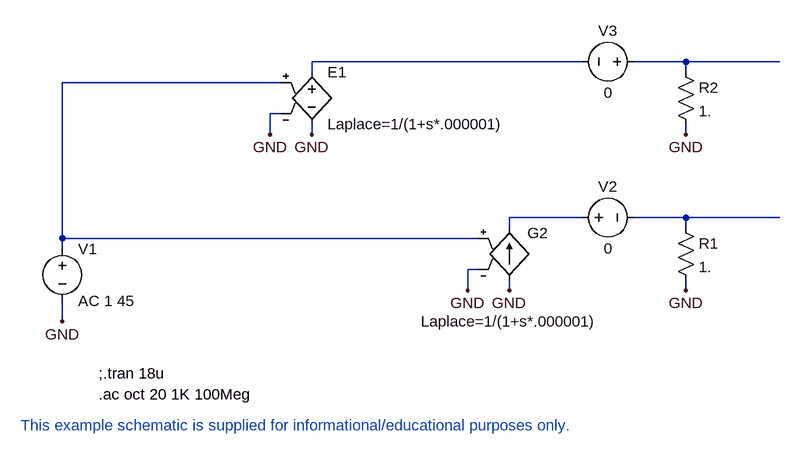
[diagram p0: schematic i.asc]
i.asc, the LTspice schematic file:
Version 4
SHEET 1 1652 896
WIRE 544 592 1184 592
WIRE 544 608 544 592
WIRE 544 688 544 720
WIRE 1232 672 1232 656
WIRE 1504 672 1504 656
WIRE 1232 576 1232 560
WIRE 1232 560 1344 560
WIRE 1504 560 1504 576
WIRE 1184 640 1168 640
WIRE 1168 640 1168 672
WIRE 1504 560 1648 560
WIRE 1424 560 1504 560
WIRE 928 432 928 416
WIRE 1504 432 1504 416
WIRE 928 336 928 320
WIRE 928 320 1344 320
WIRE 1504 320 1504 336
WIRE 880 400 864 400
WIRE 864 400 864 432
WIRE 1504 320 1648 320
WIRE 1424 320 1504 320
WIRE 880 352 544 352
WIRE 544 352 544 592
FLAG 544 720 GND
FLAG 1504 672 GND
FLAG 1232 672 GND
FLAG 1168 672 GND
FLAG 1504 432 GND
FLAG 928 432 GND
FLAG 864 432 GND
SYMBOL VOLTAGE 544 592 R0
SYMATTR InstName V1
SYMATTR Value AC 1 45
SYMBOL G 1232 560 R0
WINDOW 0 28 24 Left 0
WINDOW 3 -136 160 Left 0
SYMATTR InstName G2
SYMATTR Value Laplace=1/(1+s*.000001)
SYMBOL RES 1488 560 R0
SYMATTR InstName R1
SYMATTR Value 1.
SYMBOL voltage 1328 560 R270
WINDOW 0 32 56 VTop 0
WINDOW 3 -32 56 VBottom 0
SYMATTR InstName V2
SYMATTR Value 0
SYMBOL RES 1488 320 R0
SYMATTR InstName R2
SYMATTR Value 1.
SYMBOL voltage 1440 320 M270
WINDOW 0 32 56 VTop 0
WINDOW 3 -32 56 VBottom 0
SYMATTR InstName V3
SYMATTR Value 0
SYMBOL e 928 320 R0
SYMATTR InstName E1
SYMATTR Value Laplace=1/(1+s*.000001)
TEXT 600 832 Left 0 !.ac oct 20 1K 100Meg
TEXT 600 800 Left 0 !;.tran 18u
text 480 880 Left 0 ;This example schematic is supplied for informational/educational purposes only.

The netlist it stands for:
* i.asc
V1 N001 GND AC 1 45
G2 GND N002 N001 GND Laplace=1/(1+s*.000001)
R1 N003 GND 1.
V2 N002 N003 0
R2 N005 GND 1.
V3 N005 N004 0
E1 N004 GND N001 GND Laplace=1/(1+s*.000001)
.ac oct 20 1K 100Meg
;.tran 18u
* This example schematic is supplied for informational/educational purposes only.
.backanno
.end